# EAGLE design ESP8266_usb_spi_connector7 (EAGLE 7.6.0)
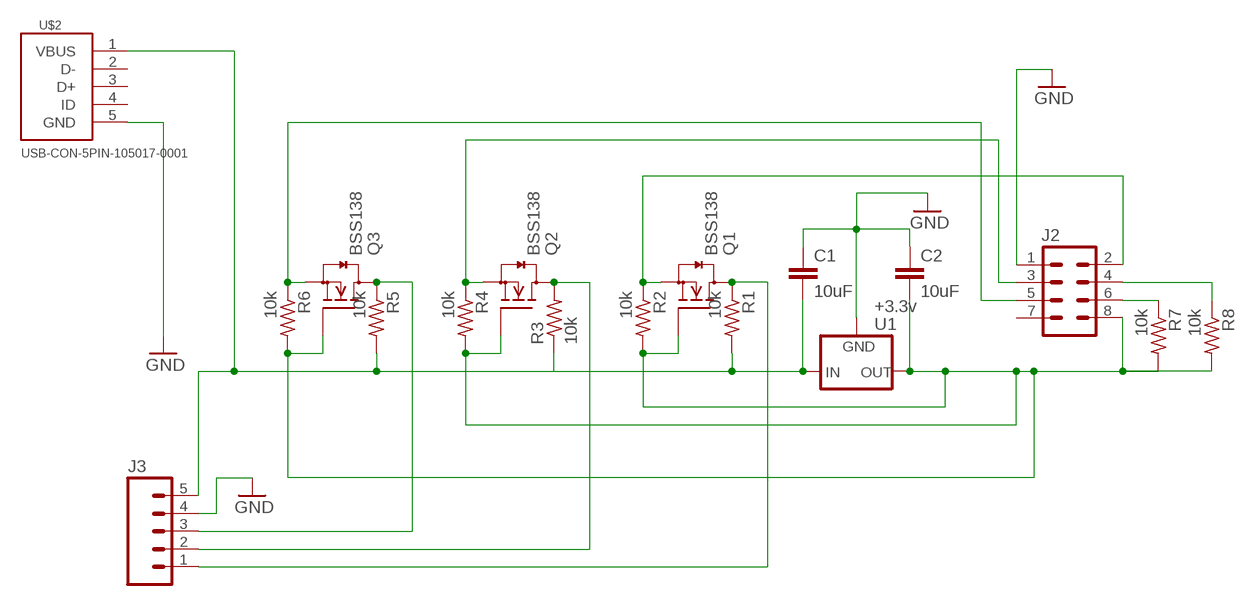
[diagram p0: schematic, sheet 1]

## Parts
C1  10uF  CAP1206  [1206]
C2  10uF  CAP1206  [1206]
J2  M04X2  [2X4]
J3  M05PTH  [1X05]
Q1  BSS138  [SOT23]
Q2  BSS138  [SOT23]
Q3  BSS138  [SOT23]
R1  10k  R-US_M1206  [M1206]
R2  10k  R-US_M1206  [M1206]
R3  10k  R-US_M1206  [M1206]
R4  10k  R-US_M1206  [M1206]
R5  10k  R-US_M1206  [M1206]
R6  10k  R-US_M1206  [M1206]
R7  10k  R-US_M1206  [M1206]
R8  10k  R-US_M1206  [M1206]
U1  +3.3v  V_REG_78XX7812  [TO-252]
U$2  USB-CON-5PIN-105017-0001  [USB-MICRO-MOLEX-105017-0001]

## Nets
GND: C1.1 C2.1 J2.1 J3.4 U1.3(GND) U$2.5(GND)
N$1: J3.3 Q3.3(D) R5.1
N$2: J2.3 Q2.2(S) R4.1
N$3: C2.2 J2.8 Q1.1(G) Q2.1(G) Q3.1(G) R2.2 R4.2 R6.2 R7.2 R8.2 U1.2(OUT)
N$4: J3.2 Q2.3(D) R3.2
N$5: J3.1 Q1.3(D) R1.1
N$7: J2.5 Q3.2(S) R6.1
N$9: J2.2 Q1.2(S) R2.1
N$10: C1.2 J3.5 R1.2 R3.1 R5.2 U1.1(IN) U$2.1(VBUS)
N$11: J2.6 R7.1
N$12: J2.4 R8.1
Unconnected: J2.7 U$2.2(D-) U$2.3(D+) U$2.4(ID)

## Library data of the parts
C1 C2 = SparkFun-Passives:CAP: Capacitor Standard 0603 ceramic capacitor, and 0.1" leaded capacitor.
J2 = SparkFun-Connectors:M04X2: .1" header, two rows of four.
J3 = SparkFun-Connectors:M05: Header 5 Standard 5-pin 0.1" header. Use with straight break away headers (SKU : PRT-00116), right angle break away headers (PRT-00553), swiss pins (PRT-00743), machine pins (PRT-00117), and female headers (PRT-00115). Molex polarized connector foot print use with SKU : PRT-08230 with associated crimp pins and housings.
Q1-Q3 = m-pad-2.1:BSS138: Fairchild Semiconductors BSS138 N-Channel Logic Level Enhancement Mode Field Effect Transistor General Description: These N-Channel enhancement mode field effect transistors are produced using Fairchild's proprietary, high cell density, DMOS technology. These products have been designed to minimize on-state resistance while provide rugged, reliable, and fast switching performance.These products are particularly suited for low voltage, low current applications such as small servo motor control, power MOSFET gate drivers, and other switching applications. Features: 0.22 A, 50 V. RDS(ON) = 3.5Ohm @ VGS = 10 V RDS(ON) = 6.0Ohm @ VGS = 4.5 V High density cell design for extremely low RDS(ON) Rugged and Reliable Compact industry standard SOT-23 surface mount package Please send any comments to: messi@users.sourceforge.net
R1-R8 = resistor:R-US_: RESISTOR, American symbol
U1 = SparkFun-PowerIC:V_REG_78XX: Voltage Regulator Standard 78xx regulator. IGO (Input Ground Output). Spark Fun Electronics SKU : COM-00107; PROD_ID: VREG-12370; VALUE: +12v
U$2 = temp:USB-CON-5PIN: Molex Micro USB 105017-0001

## Board
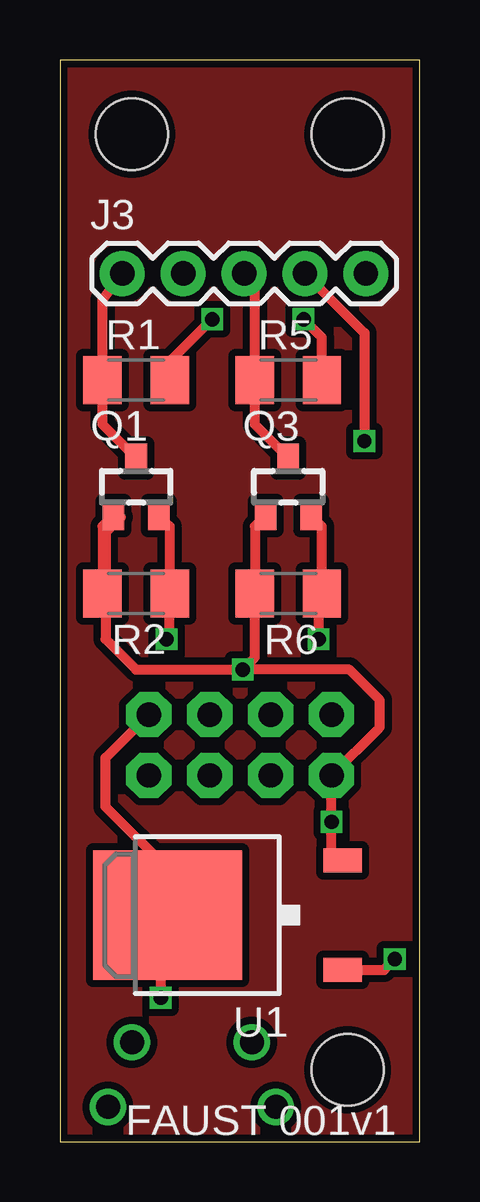
[diagram p1: board, top side]
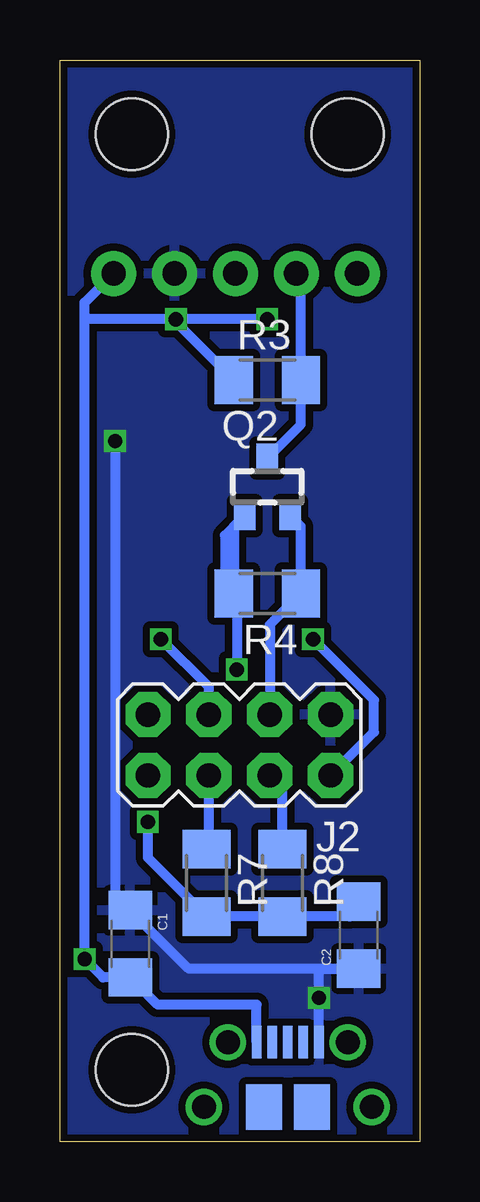
[diagram p2: board, bottom side, seen from below]

Size 15 x 45.09 mm. Coordinates in mm from the lower left corner, seen from the top.
Outline: 0,0 15,0 15,45.09 0,45.09 0,0
Copper layers (1*16): Top 0.035mm / dielectric 1.5mm / Bottom 0.035mm
Design rules "SeeedStudio_2layer_DRU_no_angle_20140221": minimum track width 6mil, minimum drill 12mil, track to track 6mil, track to pad 6mil, pad to pad 6mil, via to via 6mil, smd to smd 0mil, copper to edge 10mil, drill to drill 10mil, minimum pad ring 10mil, minimum via ring 6mil, stop-mask expansion 2mil, vias tented up to drill 100mil, thermal gap 10mil
Holes 3 mm at 12,3 12,42 3,42

### Footprints (pad centres in the part's own frame; a part is rotated, then mirrored left to right if it is on the bottom)
1206 = smd 1.6 x 1.8: 1 -1.4,0; 2 1.4,0
2X4 = drill 1.016 pad 1.88 octagon: 1 -3.81,-1.27; 2 -3.81,1.27; 3 -1.27,-1.27; 4 -1.27,1.27; 5 1.27,-1.27; 6 1.27,1.27; 7 3.81,-1.27; 8 3.81,1.27
1X05 = drill 1.016 pad 1.88: 1 0,0; 2 2.54,0; 3 5.08,0; 4 7.62,0; 5 10.16,0
SOT23 = smd 0.9 x 1.2: 1 -0.95,-1.2; 2 0.95,-1.2; 3 0,1.2
M1206 = smd 1.6 x 2: 1 -1.4,0; 2 1.4,0
TO-252 = smd 1 x 1.6: 1 -2.28,-4.8; 2 2.28,-4.8 | smd 5.4 x 6.2: 3 0,2.5
USB-MICRO-MOLEX-105017-0001 = smd 0.4 x 1.35: 1 1.2,0; 2 1.85,0; 3 2.5,0; 4 3.15,0; 5 3.8,0 | drill 1 pad 1.45: P$1 0,0; P$2 5,0; P$5 6,-2.7; P$6 -1,-2.7 | smd 1.5 x 1.9: P$3 3.5,-2.7; P$4 1.5,-2.7

### Placement (x,y rotation side)
C1  12.06,8.26 270 bottom
C2  2.54,8.62 90 bottom
J2  7.52,16.54 180 bottom
J3  2.6,36.2 0 top
Q1  3.17,27.3 0 top
Q2  6.35,27.3 0 bottom
Q3  9.53,27.3 0 top
R1  3.17,31.75 0 top
R2  3.17,22.86 180 top
R3  6.35,31.75 0 bottom
R4  6.35,22.86 180 bottom
R5  9.53,31.75 0 top
R6  9.53,22.86 180 top
R7  8.89,10.79 270 bottom
R8  5.71,10.79 270 bottom
U1  6.99,9.45 90 top
U$2  8,4.15 0 bottom

### Tracks (layer width: path | path; a pad name or v marks a point on that pad's centre or on a via)
GND  (via drill 0.6)
  Top 0.406: J3.4 12.7,33.72 v12.7,29.21 | 3.71,17.68 J2.1 1.91,16 1.91,13.97 4.49,11.39 U1.3 4.2,9.45 v4.2,6
  Bottom 0.406: v12.7,29.21 12.7,9.65 C1.1 9.63,7.22 C2.1 4.2,7.22 v4.2,6 U$2.5
  pour Bottom (isolate 0.305): 0,0 15,0 15,45 0,45
N$1
  Top 0.406: J3.3 8.12,35.48 R5.1 8.12,29.91 Q3.3
N$2
  Bottom 0.406: Q2.2 4.95,25.66 R4.1 6.25,21.56 J2.3
N$3  (via drill 0.6)
  Top 0.406: Q3.1 8.12,25.66 R6.2 8.12,20.19 v7.62,19.68 | U1.2 11.43,11.45 11.43,11.43 11.33,11.53 v11.33,13.34 J2.8 13.34,17.27 13.34,18.41 12.06,19.68 v7.62,19.68 | R2.2 1.77,25.66 Q1.1 2.29,26.04 2.54,26.04 1.91,25.4 1.91,20.95 3.17,19.68 v7.62,19.68
  Bottom 0.406: Q2.1 7.75,25.66 | 7.75,25.66 R4.2 | 7.75,25.66 8.12,25.28 R6.2 7.62,22.36 v7.62,19.68 | C2.2 2.92,9.39 R8.2 R7.2 11.33,11.84 v11.33,13.34
N$4
  Bottom 0.406: Q2.3 4.95,29.91 R3.2 4.95,35.92 J3.2
N$5
  Top 0.406: J3.1 1.77,35.1 R1.1 1.77,29.91 Q1.3
N$7  (via drill 0.6)
  Top 0.406: R6.1 10.79,22.86 | R6.1 10.93,25.66 Q3.2 | v10.79,20.95 10.79,22.73 R6.1
  Bottom 0.406: J2.5 8.79,18.95 v10.79,20.95
N$8
  pour Top (isolate 0.305): 0,0 15,0 15,45 0,45
N$9  (via drill 0.6)
  Top 0.406: Q1.2 4.58,25.66 R2.1 4.58,21.09 v4.45,20.95
  Bottom 0.406: J2.2 1.91,17.07 1.91,18.41 v4.45,20.95
N$10  (via drill 0.6)
  Top 0.406: U1.1 13.52,7.17 v13.97,7.62 | v6.35,34.29 4.58,32.52 R1.2 | v10.16,34.29 10.93,33.52 R5.2
  Bottom 0.406: 13.84,7.49 v13.97,7.62 | v13.97,7.62 13.97,34.29 | 13.97,34.29 13.97,34.98 J3.5 | R3.1 10.22,34.23 | 10.22,34.23 10.29,34.29 13.97,34.29 | v6.35,34.29 v10.16,34.29 10.22,34.23 | v13.97,7.62 13.21,6.86 C1.2 10.93,5.71 6.8,5.71 U$2.1
N$11
  Bottom 0.406: R7.1 8.79,12.29 J2.6
N$12
  Bottom 0.406: R8.1 5.71,14.73 J2.4

### Text on the board
tPlace: FAUST 001v1